# EasyEDA Pro project Dispenser Motor Controller.eprj, schematic Schematic1

## Sheets
1 P1: Board Name: Board1; Create Date: 2025-08-19; Page Name: P1; Project Name: Dispenser Motor Controller; Schematic Name: Schematic1; Update Date: 2025-12-11; Company: EasyEDA.com; Page Size: A4; Version: V1.0
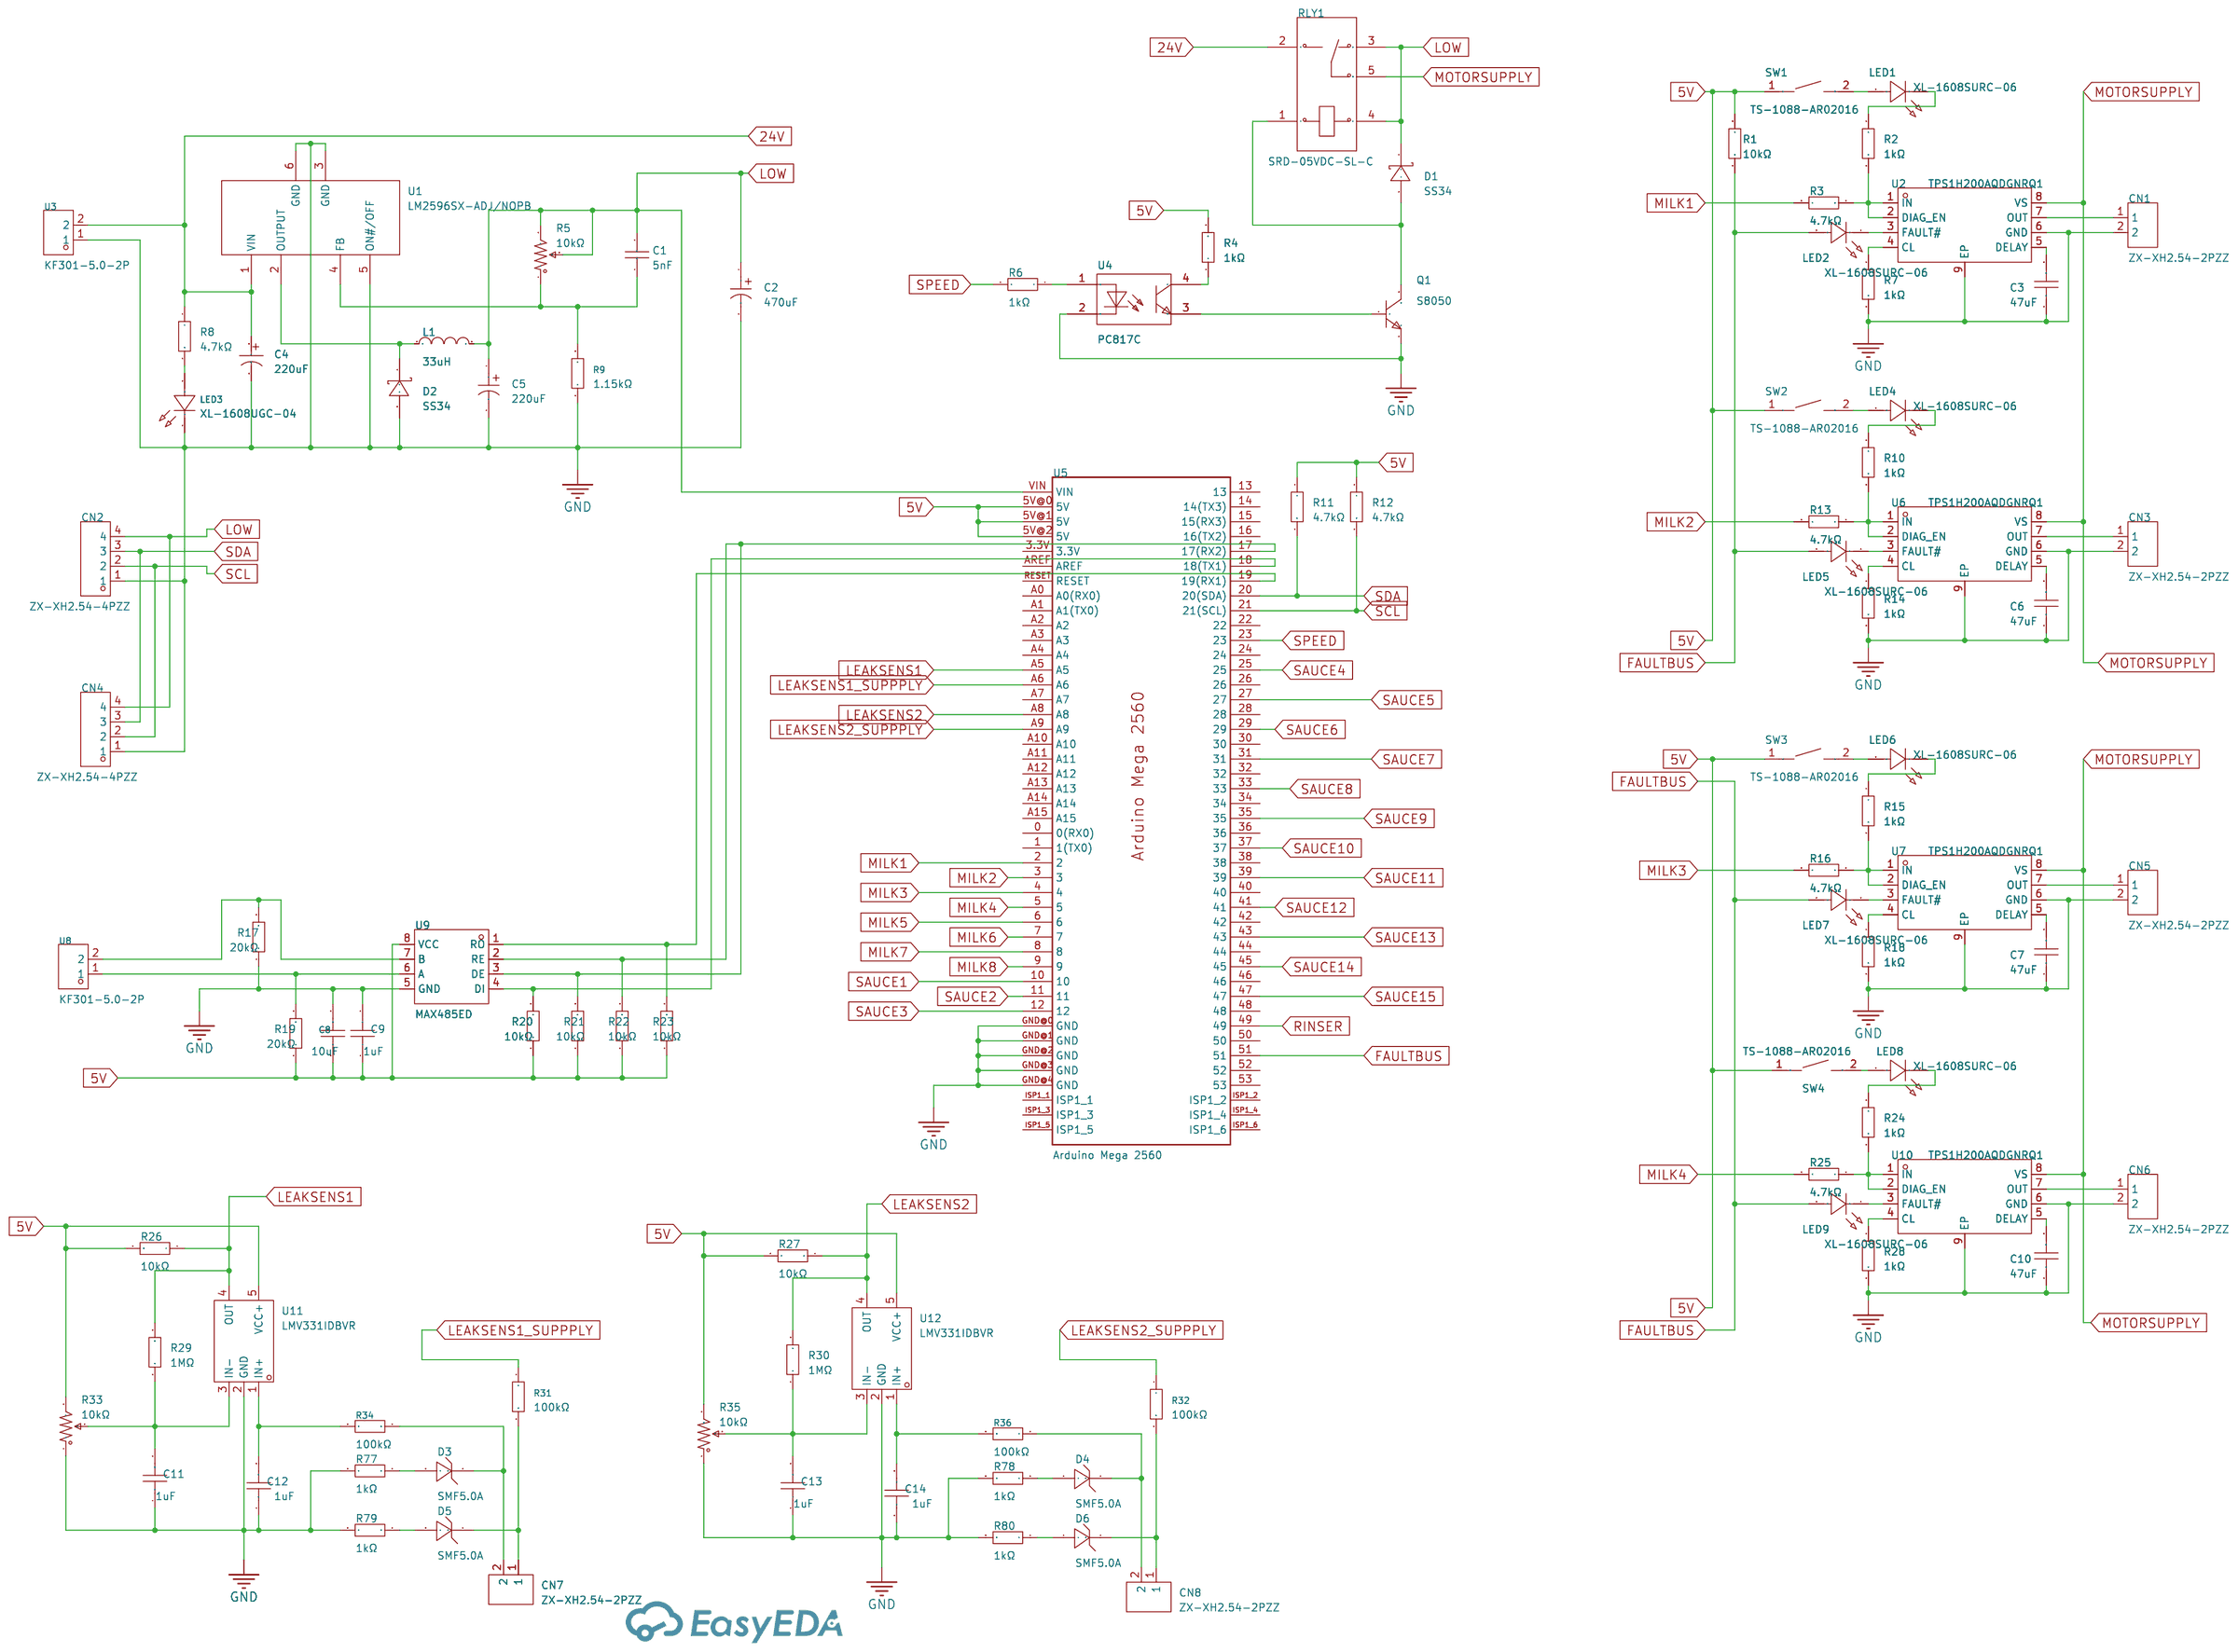
[diagram p0: P1]
2 P2: Create Date: 2025-08-20; Page Name: P2; Update Date: 2025-11-22
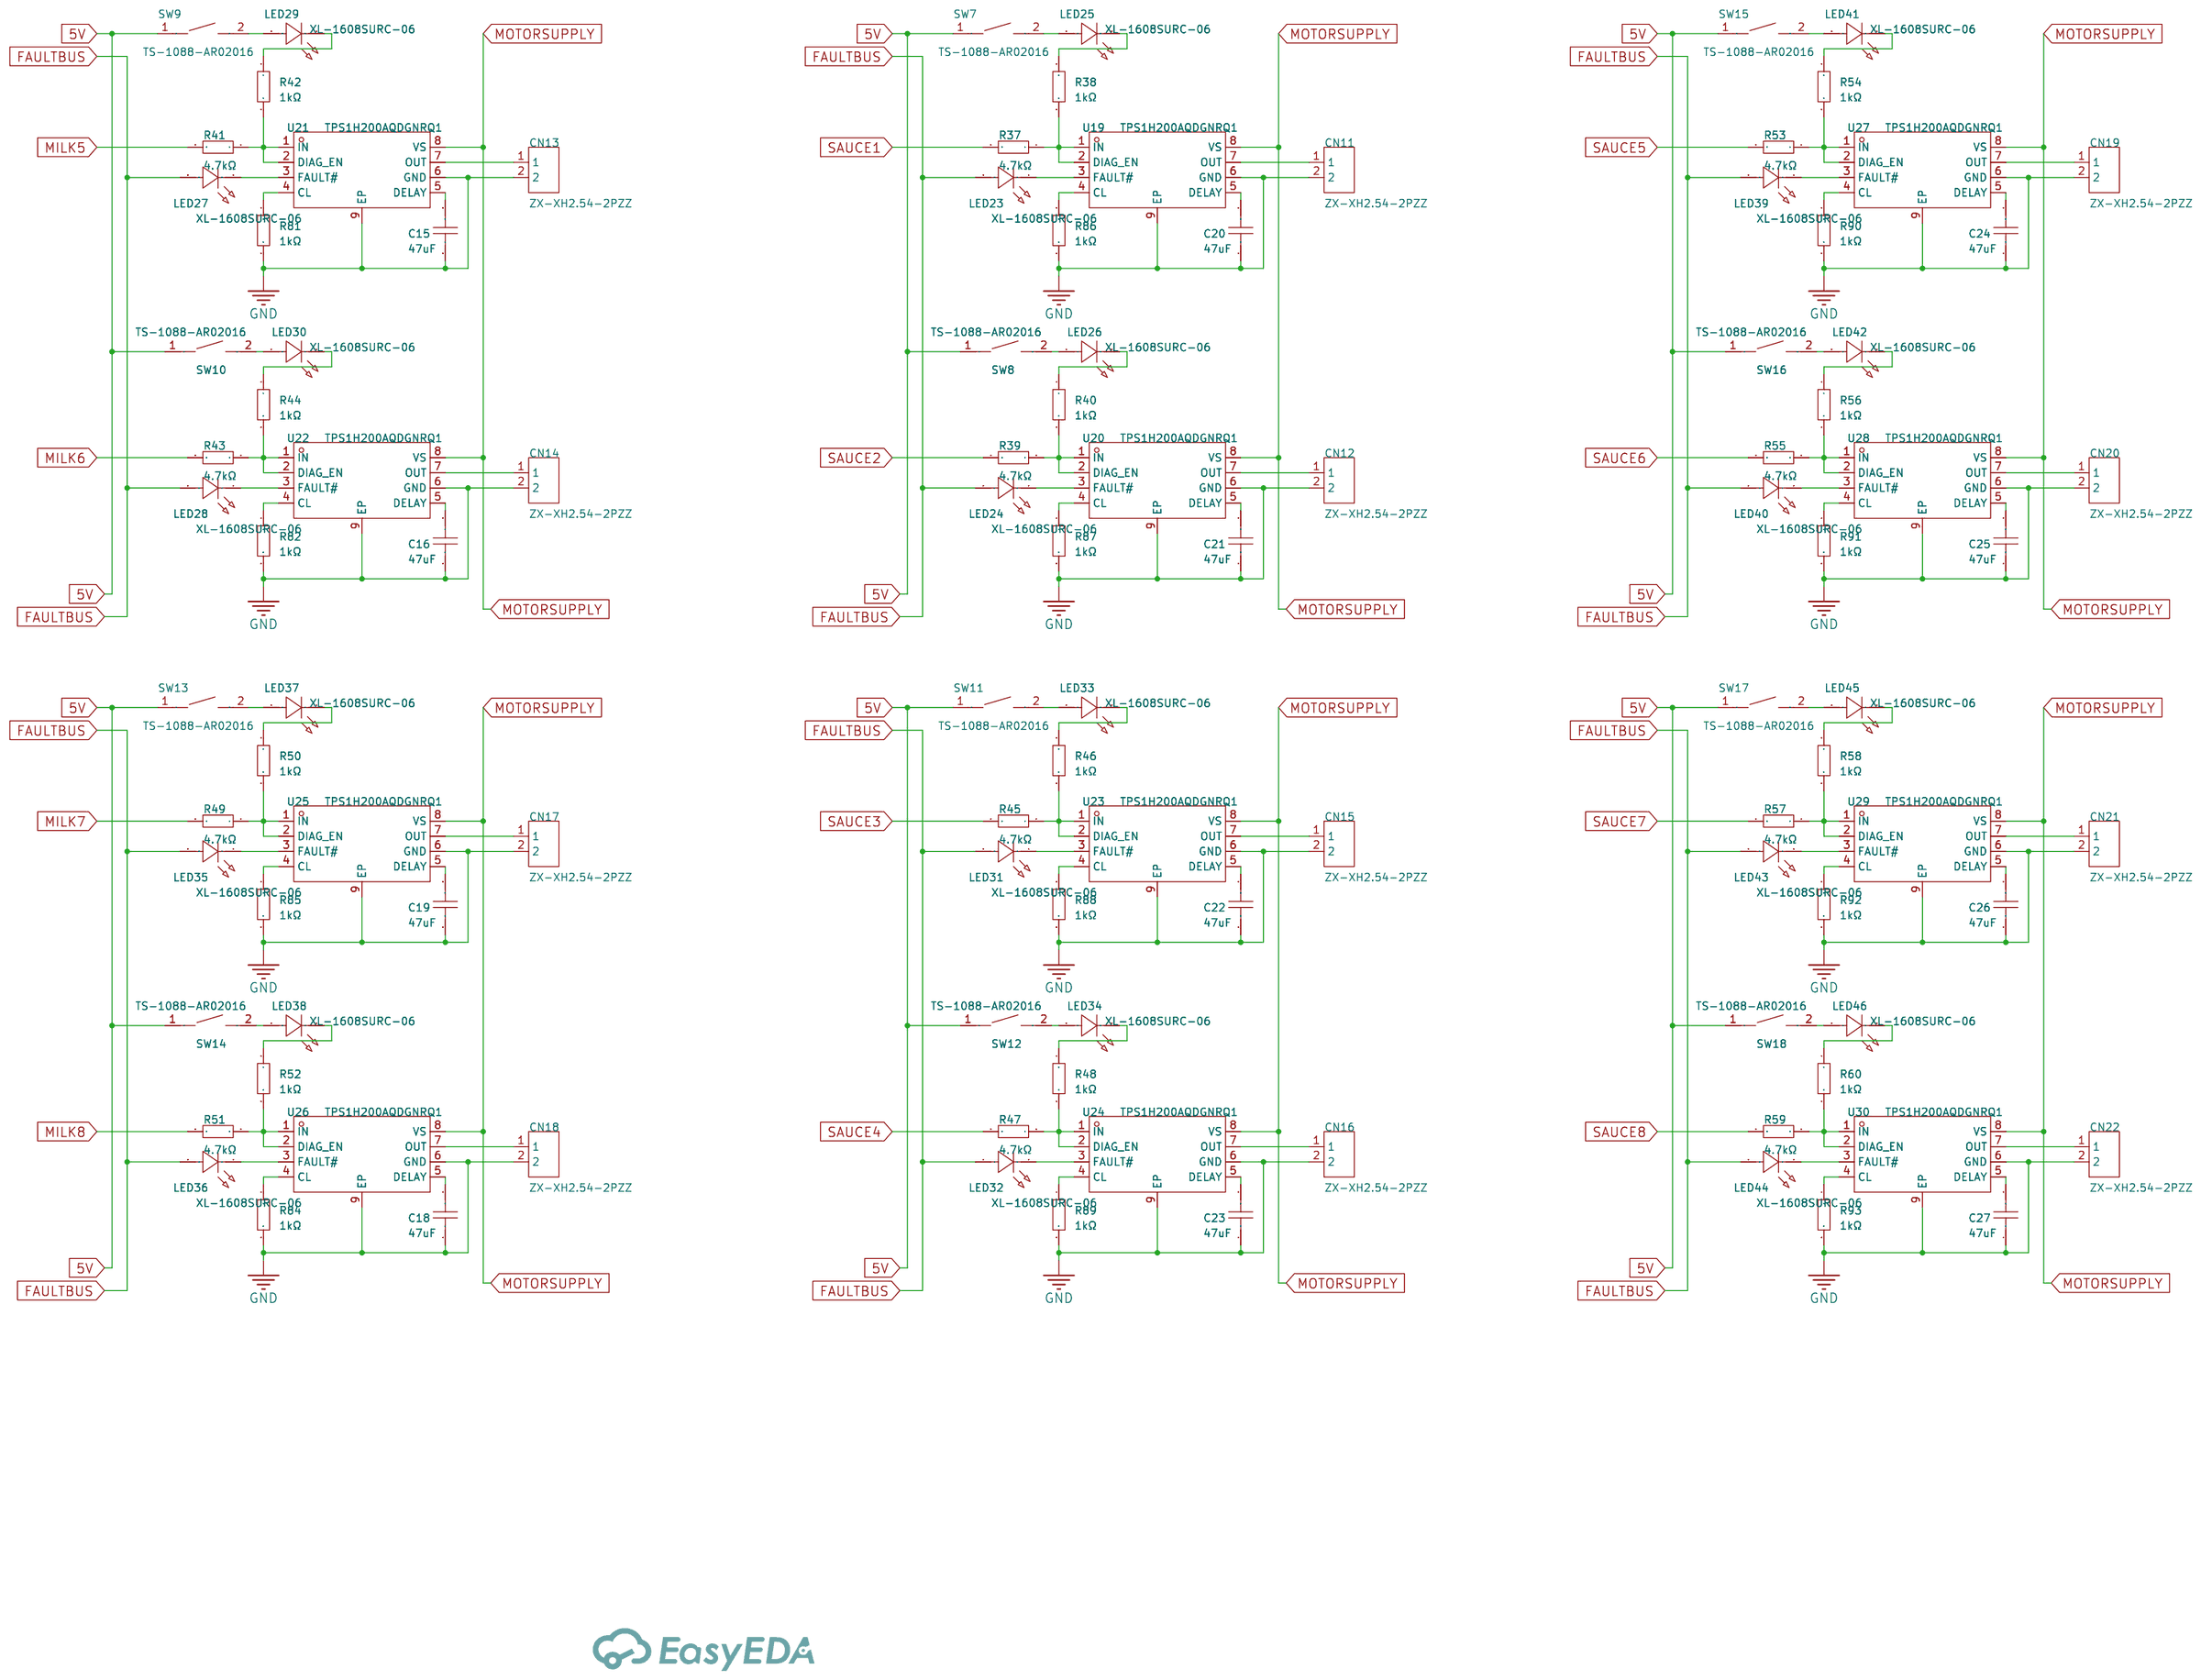
[diagram p1: P2]
3 P3: Create Date: 2025-08-20; Page Name: P3; Update Date: 2025-11-22
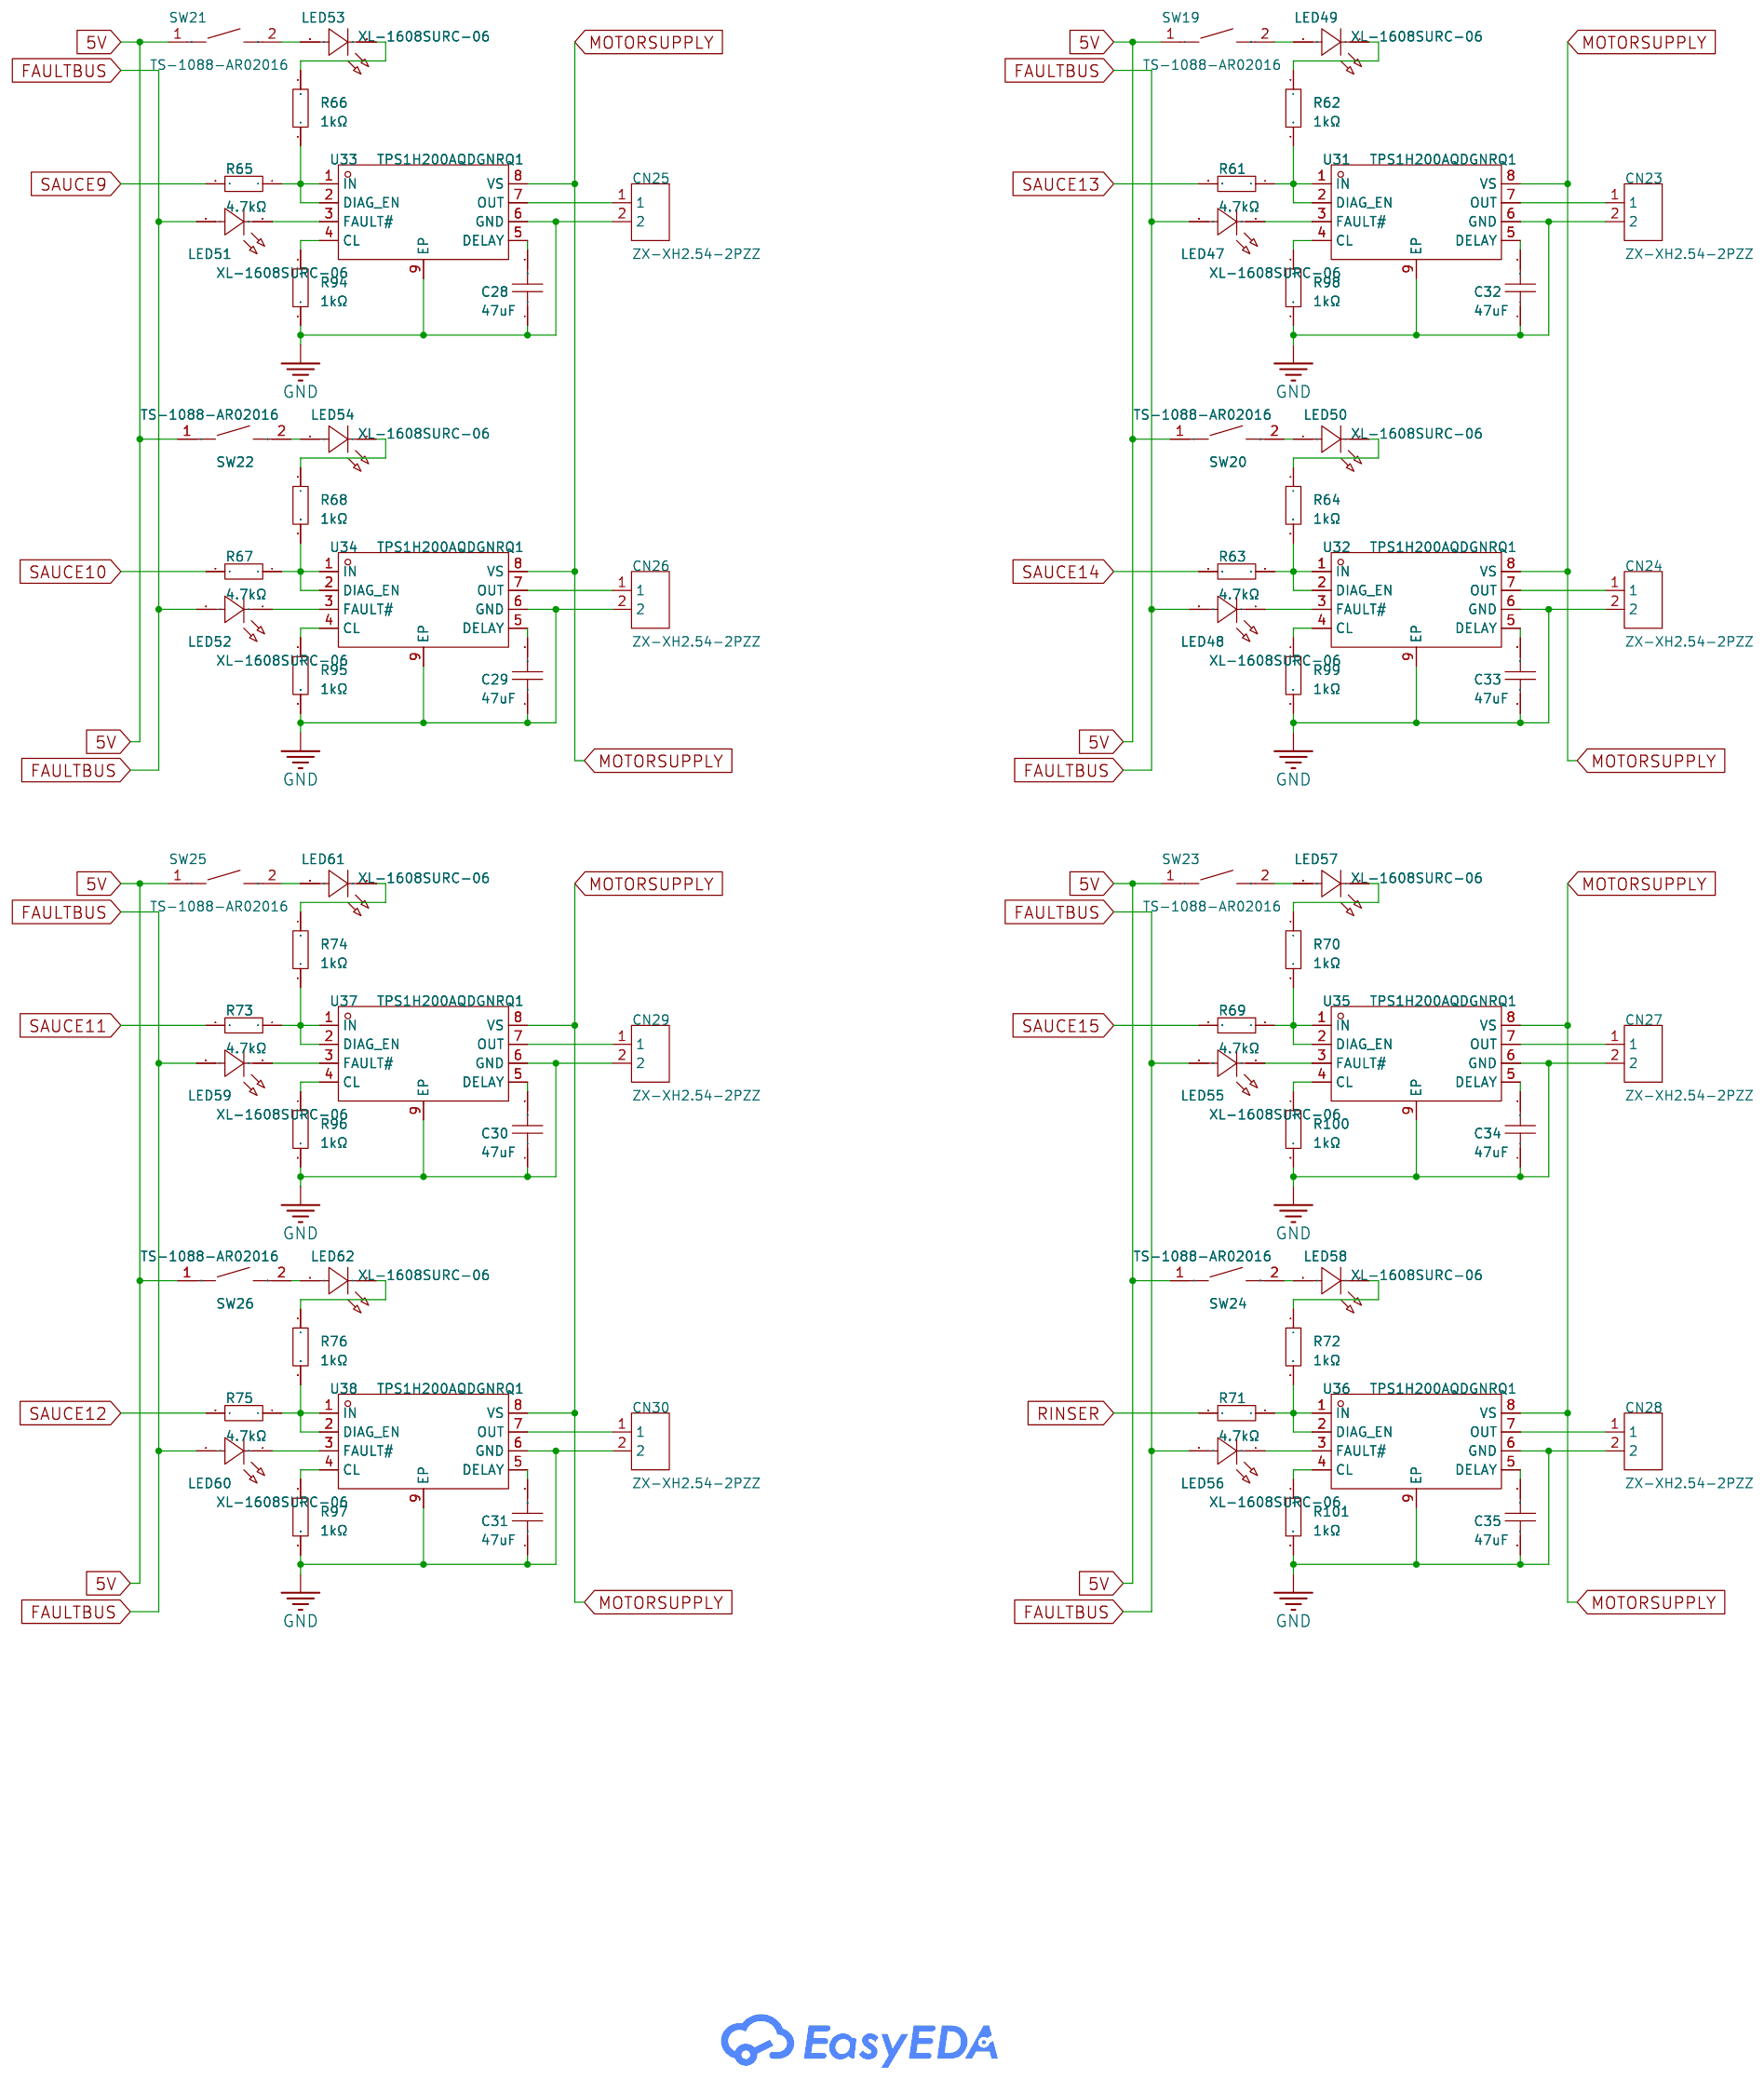
[diagram p2: P3]

## Parts
sheet P1
C1  5nF  [C0805]
C2  470uF  [CAP-SMD_BD8.0-L8.3-W8.3-LS9.1-FD]
C3  47uF  [C0603]
C4  220uF  [CAP-SMD_BD10.0-L10.3-W10.3-LS11.3-FD]
C5  220uF  [CAP-SMD_BD6.3-L6.6-W6.6-LS7.4-FD]
C6  47uF  [C0603]
C7  47uF  [C0603]
C8  10uF  [C0603]
C9  1uF  [C0603]
C10  47uF  [C0603]
C11  1uF  [C0603]
C12  1uF  [C0603]
C13  1uF  [C0603]
C14  1uF  [C0603]
CN1  ZX-XH2.54-2PZZ  [CONN-TH_2P-P2.50_HX25003-2A]
CN2  ZX-XH2.54-4PZZ  [CONN-TH_4P-P2.50_4PIN]
CN3  ZX-XH2.54-2PZZ  [CONN-TH_2P-P2.50_HX25003-2A]
CN4  ZX-XH2.54-4PZZ  [CONN-TH_4P-P2.50_4PIN]
CN5  ZX-XH2.54-2PZZ  [CONN-TH_2P-P2.50_HX25003-2A]
CN6  ZX-XH2.54-2PZZ  [CONN-TH_2P-P2.50_HX25003-2A]
CN7  ZX-XH2.54-2PZZ  [CONN-TH_2P-P2.50_HX25003-2A]
CN8  ZX-XH2.54-2PZZ  [CONN-TH_2P-P2.50_HX25003-2A]
D1  SS34  [SMA_L4.3-W2.6-LS5.2-RD]
D2  SS34  [SMA_L4.3-W2.6-LS5.2-RD]
D3  SMF5.0A  [SOD-123FL_L2.7-W1.8-LS3.8-RD]
D4  SMF5.0A  [SOD-123FL_L2.7-W1.8-LS3.8-RD]
D5  SMF5.0A  [SOD-123FL_L2.7-W1.8-LS3.8-RD]
D6  SMF5.0A  [SOD-123FL_L2.7-W1.8-LS3.8-RD]
L1  33uH  [IND-SMD_L12.3-W12.3]
LED1  XL-1608SURC-06  [LED0603-RD_RED]
LED2  XL-1608SURC-06  [LED0603-RD_RED]
LED3  XL-1608UGC-04  [LED0603-RD_GREEN]
LED4  XL-1608SURC-06  [LED0603-RD_RED]
LED5  XL-1608SURC-06  [LED0603-RD_RED]
LED6  XL-1608SURC-06  [LED0603-RD_RED]
LED7  XL-1608SURC-06  [LED0603-RD_RED]
LED8  XL-1608SURC-06  [LED0603-RD_RED]
LED9  XL-1608SURC-06  [LED0603-RD_RED]
Q1  S8050  [SOT-23-3_L2.9-W1.6-P1.90-LS2.8-BR]
R1  10kΩ  [R0603]
R2  1kΩ  [R0603]
R3  4.7kΩ  [R0603]
R4  1kΩ  [R0603]
R5  10kΩ  [RES-ADJ-TH_3P-L10.0-W10.0-P2.50-L]
R6  1kΩ  [R0603]
R7  1kΩ  [R0603]
R8  4.7kΩ  [R0603]
R9  1.15kΩ  [R0603]
R10  1kΩ  [R0603]
R11  4.7kΩ  [R0603]
R12  4.7kΩ  [R0603]
R13  4.7kΩ  [R0603]
R14  1kΩ  [R0603]
R15  1kΩ  [R0603]
R16  4.7kΩ  [R0603]
R17  20kΩ  [R0603]
R18  1kΩ  [R0603]
R19  20kΩ  [R0603]
R20  10kΩ  [R0603]
R21  10kΩ  [R0603]
R22  10kΩ  [R0603]
R23  10kΩ  [R0603]
R24  1kΩ  [R0603]
R25  4.7kΩ  [R0603]
R26  10kΩ  [R0603]
R27  10kΩ  [R0603]
R28  1kΩ  [R0603]
R29  1MΩ  [R0603]
R30  1MΩ  [R0603]
R31  100kΩ  [R0603]
R32  100kΩ  [R0603]
R33  10kΩ  [RES-ADJ-TH_3P-L10.0-W10.0-P2.50-L]
R34  100kΩ  [R0603]
R35  10kΩ  [RES-ADJ-TH_3P-L10.0-W10.0-P2.50-L]
R36  100kΩ  [R0603]
R77  1kΩ  [R0603]
R78  1kΩ  [R0603]
R79  1kΩ  [R0603]
R80  1kΩ  [R0603]
RLY1  SRD-05VDC-SL-C  [RELAY-TH_SRD-XXVDC-XL-C]
SW1  TS-1088-AR02016  [SW-SMD_L3.9-W3.0-P4.45]
SW2  TS-1088-AR02016  [SW-SMD_L3.9-W3.0-P4.45]
SW3  TS-1088-AR02016  [SW-SMD_L3.9-W3.0-P4.45]
SW4  TS-1088-AR02016  [SW-SMD_L3.9-W3.0-P4.45]
U1  LM2596SX-ADJ/NOPB  [TO-263-5_L10.2-W8.9-P1.70-TL]
U2  TPS1H200AQDGNRQ1  [EMSOP-8_L3.0-W3.0-P0.65-LS4.9-BL-EP-A]
U3  KF301-5.0-2P  [CONN-TH_P5.00_KF301-5.0-2P]
U4  PC817C  [OPTO-SMD-4_L4.6-W6.5-P2.54-LS10.3-TL]
U5  Arduino Mega 2560  [ARDUINO MEGA 2560 ADDON ON PCB]
U6  TPS1H200AQDGNRQ1  [EMSOP-8_L3.0-W3.0-P0.65-LS4.9-BL-EP-A]
U7  TPS1H200AQDGNRQ1  [EMSOP-8_L3.0-W3.0-P0.65-LS4.9-BL-EP-A]
U8  KF301-5.0-2P  [CONN-TH_P5.00_KF301-5.0-2P]
U9  MAX485ED  [SOP-8_L4.9-W3.9-P1.27-LS6.0-BL]
U10  TPS1H200AQDGNRQ1  [EMSOP-8_L3.0-W3.0-P0.65-LS4.9-BL-EP-A]
U11  LMV331IDBVR  [SOT-23-5_L3.0-W1.7-P0.95-LS2.8-BR]
U12  LMV331IDBVR  [SOT-23-5_L3.0-W1.7-P0.95-LS2.8-BR]
sheet P2
C15  47uF  [C0603]
C16  47uF  [C0603]
C18  47uF  [C0603]
C19  47uF  [C0603]
C20  47uF  [C0603]
C21  47uF  [C0603]
C22  47uF  [C0603]
C23  47uF  [C0603]
C24  47uF  [C0603]
C25  47uF  [C0603]
C26  47uF  [C0603]
C27  47uF  [C0603]
CN11  ZX-XH2.54-2PZZ  [CONN-TH_2P-P2.50_HX25003-2A]
CN12  ZX-XH2.54-2PZZ  [CONN-TH_2P-P2.50_HX25003-2A]
CN13  ZX-XH2.54-2PZZ  [CONN-TH_2P-P2.50_HX25003-2A]
CN14  ZX-XH2.54-2PZZ  [CONN-TH_2P-P2.50_HX25003-2A]
CN15  ZX-XH2.54-2PZZ  [CONN-TH_2P-P2.50_HX25003-2A]
CN16  ZX-XH2.54-2PZZ  [CONN-TH_2P-P2.50_HX25003-2A]
CN17  ZX-XH2.54-2PZZ  [CONN-TH_2P-P2.50_HX25003-2A]
CN18  ZX-XH2.54-2PZZ  [CONN-TH_2P-P2.50_HX25003-2A]
CN19  ZX-XH2.54-2PZZ  [CONN-TH_2P-P2.50_HX25003-2A]
CN20  ZX-XH2.54-2PZZ  [CONN-TH_2P-P2.50_HX25003-2A]
CN21  ZX-XH2.54-2PZZ  [CONN-TH_2P-P2.50_HX25003-2A]
CN22  ZX-XH2.54-2PZZ  [CONN-TH_2P-P2.50_HX25003-2A]
LED23  XL-1608SURC-06  [LED0603-RD_RED]
LED24  XL-1608SURC-06  [LED0603-RD_RED]
LED25  XL-1608SURC-06  [LED0603-RD_RED]
LED26  XL-1608SURC-06  [LED0603-RD_RED]
LED27  XL-1608SURC-06  [LED0603-RD_RED]
LED28  XL-1608SURC-06  [LED0603-RD_RED]
LED29  XL-1608SURC-06  [LED0603-RD_RED]
LED30  XL-1608SURC-06  [LED0603-RD_RED]
LED31  XL-1608SURC-06  [LED0603-RD_RED]
LED32  XL-1608SURC-06  [LED0603-RD_RED]
LED33  XL-1608SURC-06  [LED0603-RD_RED]
LED34  XL-1608SURC-06  [LED0603-RD_RED]
LED35  XL-1608SURC-06  [LED0603-RD_RED]
LED36  XL-1608SURC-06  [LED0603-RD_RED]
LED37  XL-1608SURC-06  [LED0603-RD_RED]
LED38  XL-1608SURC-06  [LED0603-RD_RED]
LED39  XL-1608SURC-06  [LED0603-RD_RED]
LED40  XL-1608SURC-06  [LED0603-RD_RED]
LED41  XL-1608SURC-06  [LED0603-RD_RED]
LED42  XL-1608SURC-06  [LED0603-RD_RED]
LED43  XL-1608SURC-06  [LED0603-RD_RED]
LED44  XL-1608SURC-06  [LED0603-RD_RED]
LED45  XL-1608SURC-06  [LED0603-RD_RED]
LED46  XL-1608SURC-06  [LED0603-RD_RED]
R37  4.7kΩ  [R0603]
R38  1kΩ  [R0603]
R39  4.7kΩ  [R0603]
R40  1kΩ  [R0603]
R41  4.7kΩ  [R0603]
R42  1kΩ  [R0603]
R43  4.7kΩ  [R0603]
R44  1kΩ  [R0603]
R45  4.7kΩ  [R0603]
R46  1kΩ  [R0603]
R47  4.7kΩ  [R0603]
R48  1kΩ  [R0603]
R49  4.7kΩ  [R0603]
R50  1kΩ  [R0603]
R51  4.7kΩ  [R0603]
R52  1kΩ  [R0603]
R53  4.7kΩ  [R0603]
R54  1kΩ  [R0603]
R55  4.7kΩ  [R0603]
R56  1kΩ  [R0603]
R57  4.7kΩ  [R0603]
R58  1kΩ  [R0603]
R59  4.7kΩ  [R0603]
R60  1kΩ  [R0603]
R81  1kΩ  [R0603]
R82  1kΩ  [R0603]
R84  1kΩ  [R0603]
R85  1kΩ  [R0603]
R86  1kΩ  [R0603]
R87  1kΩ  [R0603]
R88  1kΩ  [R0603]
R89  1kΩ  [R0603]
R90  1kΩ  [R0603]
R91  1kΩ  [R0603]
R92  1kΩ  [R0603]
R93  1kΩ  [R0603]
SW7  TS-1088-AR02016  [SW-SMD_L3.9-W3.0-P4.45]
SW8  TS-1088-AR02016  [SW-SMD_L3.9-W3.0-P4.45]
SW9  TS-1088-AR02016  [SW-SMD_L3.9-W3.0-P4.45]
SW10  TS-1088-AR02016  [SW-SMD_L3.9-W3.0-P4.45]
SW11  TS-1088-AR02016  [SW-SMD_L3.9-W3.0-P4.45]
SW12  TS-1088-AR02016  [SW-SMD_L3.9-W3.0-P4.45]
SW13  TS-1088-AR02016  [SW-SMD_L3.9-W3.0-P4.45]
SW14  TS-1088-AR02016  [SW-SMD_L3.9-W3.0-P4.45]
SW15  TS-1088-AR02016  [SW-SMD_L3.9-W3.0-P4.45]
SW16  TS-1088-AR02016  [SW-SMD_L3.9-W3.0-P4.45]
SW17  TS-1088-AR02016  [SW-SMD_L3.9-W3.0-P4.45]
SW18  TS-1088-AR02016  [SW-SMD_L3.9-W3.0-P4.45]
U19  TPS1H200AQDGNRQ1  [EMSOP-8_L3.0-W3.0-P0.65-LS4.9-BL-EP-A]
U20  TPS1H200AQDGNRQ1  [EMSOP-8_L3.0-W3.0-P0.65-LS4.9-BL-EP-A]
U21  TPS1H200AQDGNRQ1  [EMSOP-8_L3.0-W3.0-P0.65-LS4.9-BL-EP-A]
U22  TPS1H200AQDGNRQ1  [EMSOP-8_L3.0-W3.0-P0.65-LS4.9-BL-EP-A]
U23  TPS1H200AQDGNRQ1  [EMSOP-8_L3.0-W3.0-P0.65-LS4.9-BL-EP-A]
U24  TPS1H200AQDGNRQ1  [EMSOP-8_L3.0-W3.0-P0.65-LS4.9-BL-EP-A]
U25  TPS1H200AQDGNRQ1  [EMSOP-8_L3.0-W3.0-P0.65-LS4.9-BL-EP-A]
U26  TPS1H200AQDGNRQ1  [EMSOP-8_L3.0-W3.0-P0.65-LS4.9-BL-EP-A]
U27  TPS1H200AQDGNRQ1  [EMSOP-8_L3.0-W3.0-P0.65-LS4.9-BL-EP-A]
U28  TPS1H200AQDGNRQ1  [EMSOP-8_L3.0-W3.0-P0.65-LS4.9-BL-EP-A]
U29  TPS1H200AQDGNRQ1  [EMSOP-8_L3.0-W3.0-P0.65-LS4.9-BL-EP-A]
U30  TPS1H200AQDGNRQ1  [EMSOP-8_L3.0-W3.0-P0.65-LS4.9-BL-EP-A]
sheet P3
C28  47uF  [C0603]
C29  47uF  [C0603]
C30  47uF  [C0603]
C31  47uF  [C0603]
C32  47uF  [C0603]
C33  47uF  [C0603]
C34  47uF  [C0603]
C35  47uF  [C0603]
CN23  ZX-XH2.54-2PZZ  [CONN-TH_2P-P2.50_HX25003-2A]
CN24  ZX-XH2.54-2PZZ  [CONN-TH_2P-P2.50_HX25003-2A]
CN25  ZX-XH2.54-2PZZ  [CONN-TH_2P-P2.50_HX25003-2A]
CN26  ZX-XH2.54-2PZZ  [CONN-TH_2P-P2.50_HX25003-2A]
CN27  ZX-XH2.54-2PZZ  [CONN-TH_2P-P2.50_HX25003-2A]
CN28  ZX-XH2.54-2PZZ  [CONN-TH_2P-P2.50_HX25003-2A]
CN29  ZX-XH2.54-2PZZ  [CONN-TH_2P-P2.50_HX25003-2A]
CN30  ZX-XH2.54-2PZZ  [CONN-TH_2P-P2.50_HX25003-2A]
LED47  XL-1608SURC-06  [LED0603-RD_RED]
LED48  XL-1608SURC-06  [LED0603-RD_RED]
LED49  XL-1608SURC-06  [LED0603-RD_RED]
LED50  XL-1608SURC-06  [LED0603-RD_RED]
LED51  XL-1608SURC-06  [LED0603-RD_RED]
LED52  XL-1608SURC-06  [LED0603-RD_RED]
LED53  XL-1608SURC-06  [LED0603-RD_RED]
LED54  XL-1608SURC-06  [LED0603-RD_RED]
LED55  XL-1608SURC-06  [LED0603-RD_RED]
LED56  XL-1608SURC-06  [LED0603-RD_RED]
LED57  XL-1608SURC-06  [LED0603-RD_RED]
LED58  XL-1608SURC-06  [LED0603-RD_RED]
LED59  XL-1608SURC-06  [LED0603-RD_RED]
LED60  XL-1608SURC-06  [LED0603-RD_RED]
LED61  XL-1608SURC-06  [LED0603-RD_RED]
LED62  XL-1608SURC-06  [LED0603-RD_RED]
R61  4.7kΩ  [R0603]
R62  1kΩ  [R0603]
R63  4.7kΩ  [R0603]
R64  1kΩ  [R0603]
R65  4.7kΩ  [R0603]
R66  1kΩ  [R0603]
R67  4.7kΩ  [R0603]
R68  1kΩ  [R0603]
R69  4.7kΩ  [R0603]
R70  1kΩ  [R0603]
R71  4.7kΩ  [R0603]
R72  1kΩ  [R0603]
R73  4.7kΩ  [R0603]
R74  1kΩ  [R0603]
R75  4.7kΩ  [R0603]
R76  1kΩ  [R0603]
R94  1kΩ  [R0603]
R95  1kΩ  [R0603]
R96  1kΩ  [R0603]
R97  1kΩ  [R0603]
R98  1kΩ  [R0603]
R99  1kΩ  [R0603]
R100  1kΩ  [R0603]
R101  1kΩ  [R0603]
SW19  TS-1088-AR02016  [SW-SMD_L3.9-W3.0-P4.45]
SW20  TS-1088-AR02016  [SW-SMD_L3.9-W3.0-P4.45]
SW21  TS-1088-AR02016  [SW-SMD_L3.9-W3.0-P4.45]
SW22  TS-1088-AR02016  [SW-SMD_L3.9-W3.0-P4.45]
SW23  TS-1088-AR02016  [SW-SMD_L3.9-W3.0-P4.45]
SW24  TS-1088-AR02016  [SW-SMD_L3.9-W3.0-P4.45]
SW25  TS-1088-AR02016  [SW-SMD_L3.9-W3.0-P4.45]
SW26  TS-1088-AR02016  [SW-SMD_L3.9-W3.0-P4.45]
U31  TPS1H200AQDGNRQ1  [EMSOP-8_L3.0-W3.0-P0.65-LS4.9-BL-EP-A]
U32  TPS1H200AQDGNRQ1  [EMSOP-8_L3.0-W3.0-P0.65-LS4.9-BL-EP-A]
U33  TPS1H200AQDGNRQ1  [EMSOP-8_L3.0-W3.0-P0.65-LS4.9-BL-EP-A]
U34  TPS1H200AQDGNRQ1  [EMSOP-8_L3.0-W3.0-P0.65-LS4.9-BL-EP-A]
U35  TPS1H200AQDGNRQ1  [EMSOP-8_L3.0-W3.0-P0.65-LS4.9-BL-EP-A]
U36  TPS1H200AQDGNRQ1  [EMSOP-8_L3.0-W3.0-P0.65-LS4.9-BL-EP-A]
U37  TPS1H200AQDGNRQ1  [EMSOP-8_L3.0-W3.0-P0.65-LS4.9-BL-EP-A]
U38  TPS1H200AQDGNRQ1  [EMSOP-8_L3.0-W3.0-P0.65-LS4.9-BL-EP-A]

## Library data of the parts
C1 = 0805B502K500NT: LCSC Part Name: 5nF ±10% 50V; Supplier Part: C1748; Manufacturer: FH(风华); Supplier Footprint: 0805; JLCPCB Part Class: Extended Part; Datasheet: https://atta.szlcsc.com/upload/public/pdf/source/20200305/C486355_26A10D38EF8C2A5C37091D0039909270.pdf; Supplier: LCSC; Tolerance: ±10%; Voltage Rating: 50V; Temperature Coefficient: X7R
C2 = GVT1E477M0810CNVC: LCSC Part Name: 470uF ±20% 25V; Supplier Part: C2983319; Manufacturer: HRK(鸿瑞凯电子); Supplier Footprint: SMD,D8xL10.5mm; JLCPCB Part Class: Extended Part; Datasheet: https://item.szlcsc.com/datasheet/GVT1E477M0810CNVC/3419605.html; Supplier: LCSC; Tolerance: ±20%; Voltage Rating: 25V; Diameter: 8mm; Height - Seated (Max): 10.5mm; Lifetime: 2000hrs@105℃; Operating Temperature: -55℃~+105℃
C3 C6 C7 C10 C15 C16 C18-C35 = CGA0603X5R476M6R3JT: LCSC Part Name: 47uF ±20% 6.3V; Supplier Part: C6119831; Manufacturer: HRE(芯声); Supplier Footprint: 0603; JLCPCB Part Class: Extended Part; Datasheet: https://item.szlcsc.com/datasheet/CGA0603X5R476M6R3JT/7062537.html; Supplier: LCSC; Tolerance: ±20%; Voltage Rating: 6.3V; Temperature Coefficient: X5R
C4 = RVT1H221M1010_C72499: LCSC Part Name: 220uF ±20% 50V; Supplier Part: C72499; Manufacturer: ROQANG(容强); Manufacturer Part: RVT1H221M1010; Supplier Footprint: SMD,D10xL10.2mm; JLCPCB Part Class: Extended Part; Datasheet: https://item.szlcsc.com/datasheet/RVT1H221M1010/73610.html; Supplier: LCSC; Tolerance: ±20%; Voltage Rating: 50V; Ripple Current: 230mA@120Hz; Diameter: 10mm; Height - Seated (Max): 10.2mm; Lifetime: 2000hrs@105℃; Operating Temperature: -40℃~+105℃
C5 = RVT1E221M0607: LCSC Part Name: 220uF ±20% 25V; Supplier Part: C2918361; Manufacturer: ROQANG(容强); Supplier Footprint: SMD,D6.3xL7.7mm; JLCPCB Part Class: Extended Part; Datasheet: https://atta.szlcsc.com/upload/public/pdf/source/20241024/87413EF5140CF44BEEEC408A2EAB4036.pdf; Supplier: LCSC; Tolerance: ±20%; Ripple Current: 150mA@120Hz; Operating Temperature: -40℃~+105℃
C8 = CL10A106MQ8NNNC: Capacitance: Tolerance:±20% Tolerance:±20% Voltage Rated: Temperature Coefficient:; LCSC Part Name: 10uF ±20% 6.3V; Supplier Part: C1691; Manufacturer: SAMSUNG(三星); Supplier Footprint: 0603; JLCPCB Part Class: Extended Part; Datasheet: https://atta.szlcsc.com/upload/public/pdf/source/20160218/1457707763339.pdf; Supplier: LCSC; Tolerance: ±20%; Check: true
C9 C11-C14 = CL10A105KB8NNNC: Capacitance: Tolerance:±10% Tolerance:±10% Voltage Rated: Temperature Coefficient:; LCSC Part Name: 1uF ±10% 50V; Supplier Part: C15849; Manufacturer: SAMSUNG(三星); Supplier Footprint: 0603; JLCPCB Part Class: Basic Part; Datasheet: https://atta.szlcsc.com/upload/public/pdf/source/20160218/1457707763339.pdf; Supplier: LCSC; Tolerance: ±10%; Check: true
CN1 CN3 CN5-CN8 CN11-CN30 = ZX-XH2.54-2PZZ: LCSC Part Name: 1x2P 间距:2.5mm 直插 系列:XH; Supplier Part: C7429632; Manufacturer: Megastar(兆星); Supplier Footprint: 插件,P=2.5mm; JLCPCB Part Class: Extended Part; Datasheet: https://item.szlcsc.com/datasheet/ZX-XH2.54-2PZZ/8427549.html; Supplier: LCSC; Pins Structure: 1x2P; Pitch: 2.5mm; Mounting Type: Through Hole; Reference Series: XH; Number of Pins: 2P; Number of Rows: 1; Number of PINs Per Row: 2; Current Rating: 3A; Contact Material: Brass; Contact Plating: Tin; Operating Temperature: -25℃~+85℃; Voltage Rating: 250V; Plastic Material: PA66; Flame Retardant Rating: UL94V-0; Color: White; Z-Height of the Board: 7mm; X-Length of Bottom Edge on Board (Spacing Line): 7.5mm; Y-Width of Bottom Edge on Board: 5.9mm
CN2 CN4 = ZX-XH2.54-4PZZ: Pins Structure:1x4P Pitch:2.5mm Mounting Type:Through Hole Reference Series:XH Number of Pins:4P Number of Rows:1 Number of PINs Per Row:4 Row Spacing:- Current Rating:3A Contact Material:Brass Contact Plating:Tin Operating Temperature:-25℃~+85℃ Operating; LCSC Part Name: 1x4P 间距:2.5mm 直插 系列:XH; Supplier Part: C7429634; Manufacturer: Megastar(兆星); Supplier Footprint: 插件,P=2.5mm; JLCPCB Part Class: Extended Part; Datasheet: https://item.szlcsc.com/datasheet/ZX-XH2.54-4PZZ/8427551.html; Supplier: LCSC; Pins Structure: 1x4P; Pitch: 2.5mm; Mounting Type: Through Hole; Reference Series: XH; Number of Pins: 4P; Number of Rows: 1; Number of PINs Per Row: 4; Current Rating: 3A; Contact Material: Brass; Contact Plating: Tin; Operating Temperature: -25℃~+85℃; Voltage Rating: 250V; Plastic Material: PA66; Flame Retardant Rating: UL94V-0; Color: White; Z-Height of the Board: 7mm; X-Length of Bottom Edge on Board (Spacing Line): 12.5mm; Y-Width of Bottom Edge on Board: 5.9mm
D1 D2 = SS34_C8678: LCSC Part Name: 电压:40V 电流:3A; Supplier Part: C8678; Manufacturer: MDD(辰达半导体); Supplier Footprint: SMA(DO-214AC); JLCPCB Part Class: Basic Part; Datasheet: https://item.szlcsc.com/datasheet/SS34/9178.html; Supplier: LCSC; Diode Configuration: Independent; Voltage - Forward(Vf@If): 550mV@3A; Voltage - DC Reverse(Vr): 40V; Current - Rectified: 3A; Reverse Leakage Current (Ir): 500uA@40V; Operating Junction Temperature Range: -55℃~+125℃
D3-D6 = SMF5.0A_C193402: LCSC Part Name: 单向TVS 5V截止 21.7A峰值脉冲; Supplier Part: C193402; Manufacturer: MDD(辰达半导体); Supplier Footprint: SOD-123FL; JLCPCB Part Class: Extended Part; Datasheet: https://item.szlcsc.com/datasheet/SMF5.0A/231120.html; Supplier: LCSC; Polarity: Unidirectional; Reverse Stand-Off Voltage (Vrwm): 5V; Clamping Voltage: 9.2V; Peak Pulse Current (Ipp): 21.7A@10/1000us; Peak Pulse Power Dissipation (Ppp): 200W@10/1000us; Voltage - Breakdown: 7V; Reverse Leakage Current (Ir): 400uA; Operating Temperature: -55℃~+150℃; Type: TVS
L1 = SMDRI127-330MT: LCSC Part Name: 33uH ±20% 5.5A; Supplier Part: C9400; Manufacturer: SXN(顺翔诺); Supplier Footprint: SMD,12.3x12.3mm; JLCPCB Part Class: Extended Part; Datasheet: https://atta.szlcsc.com/upload/public/pdf/source/20210810/6F96FDC19AA308DD2AD166FFB9640E87.pdf; Supplier: LCSC; Tolerance: ±20%; Saturation Current (Isat): 5.5A; Type: 屏蔽电感
LED1 LED2 LED4-LED9 LED23-LED62 = XL-1608SURC-06: Supplier Part: C965799; Manufacturer: XINGLIGHT(成兴光); Supplier Footprint: 0603; JLCPCB Part Class: Extended Part; Datasheet: https://atta.szlcsc.com/upload/public/pdf/source/20250213/F9766CE804AF391355DCDD48DB3E0DAB.pdf; Supplier: LCSC; Illumination Color: Red; Voltage - Forward(Vf): 2.3V; Power(Watts): 50mW; Forward Current: 20mA; Wavelength - Dominant: 620nm~630nm; Peak Wavelength: 625nm; Lens Color: Colorless Transparent Lens; Luminous Intensity: 225mcd; Viewing Angle: 120°; Mounting Sytle: Positive Stick; Operating Temperature: -20℃~+85℃
LED3 = XL-1608UGC-04: Lamp Holder Type:- Illumination Color:Emerald Green Voltage - Forward(Vf):3.3V Voltage - Forward(Vf):3.3V Power(Watts):70mW Forward Current:20mA Wavelength - Dominant:515nm~535nm Wavelength - Dominant:515nm~535nm Peak Wavelength:525nm Diode Configuration:; Supplier Part: C965804; Manufacturer: XINGLIGHT(成兴光); Supplier Footprint: 0603; JLCPCB Part Class: Extended Part; Datasheet: https://atta.szlcsc.com/upload/public/pdf/source/20250225/C314F1E3DD818220782E352D4A9DC75E.pdf; Supplier: LCSC; Illumination Color: Emerald Green; Voltage - Forward(Vf): 3.3V; Power(Watts): 70mW; Forward Current: 20mA; Wavelength - Dominant: 515nm~535nm; Peak Wavelength: 525nm; Diode Configuration: Discrete Diode; Lens Color: Water Clear; Luminous Intensity: 810mcd; Viewing Angle: 120°; Mounting Style: op View Mount; Check: true
Q1 = S8050_C181158: LCSC Part Name: NPN 电流:500mA 耐压:25V H档; Supplier Part: C181158; Manufacturer: Hottech(合科泰); Supplier Footprint: SOT-23; JLCPCB Part Class: Extended Part; Datasheet: https://atta.szlcsc.com/upload/public/pdf/source/20220506/D987F39D56F2975D34EC7947E75C4ABC.pdf; Supplier: LCSC; Transition Frequency (fT): 150MHz; Collector Cut-Off Current (Icbo): 100nA; Collector-Emitter Saturation Voltage (VCE(sat)@Ic,Ib): 600mV@500mA,50mA
R1 R20-R23 R26 R27 = RC0603FR-0710KL: Type:Thick Film Resistors Resistance: Tolerance:±1% Tolerance:±1% Power(Watts): Overload Voltage (Max): Temperature Coefficient:±100ppm/℃ Temperature Coefficient:±100ppm/℃ Operating Temperature Range:-55℃~+155℃ Operating Temperature Range:-55℃~+155℃; LCSC Part Name: 厚膜电阻 10kΩ ±1% 100mW; Supplier Part: C98220; Manufacturer: YAGEO(国巨); Supplier Footprint: 0603; JLCPCB Part Class: Extended Part; Datasheet: https://atta.szlcsc.com/upload/public/pdf/source/20180927/C295883_E8D83085EA81BD7DE0B2B681138C15EE.pdf; Supplier: LCSC; Type: Thick Film Resistors; Tolerance: ±1%; Temperature Coefficient: ±100ppm/℃; Operating Temperature Range: -55℃~+155℃; Check: true
R2 R4 R6 R7 R10 R14 R15 R18 R24 R28 R38 R40 R42 R44 R46 R48 R50 R52 R54 R56 R58 R60 R62 R64 R66 R68 R70 R72 R74 R76-R82 R84-R101 = 0603WAF1001T5E: Type:Thick Film Resistors Resistance:1kΩ Tolerance:±1% Tolerance:±1% Power(Watts): Overload Voltage (Max): Temperature Coefficient:±100ppm/℃ Temperature Coefficient:±100ppm/℃ Operating Temperature Range:-55℃~+155℃ Operating Temperature Range:-55℃~+155℃; LCSC Part Name: 1kΩ ±1% 100mW 厚膜电阻; Supplier Part: C21190; Manufacturer: UNI-ROYAL(厚声); Supplier Footprint: 0603; JLCPCB Part Class: Basic Part; Datasheet: https://atta.szlcsc.com/upload/public/pdf/source/20200306/C422600_1E6D84923E4A46A82E41ADD87F860B5C.pdf; Supplier: LCSC; Type: Thick Film Resistors; Tolerance: ±1%; Temperature Coefficient: ±100ppm/℃; Operating Temperature Range: -55℃~+155℃
R3 R8 R11-R13 R16 R25 R37 R39 R41 R43 R45 R47 R49 R51 R53 R55 R57 R59 R61 R63 R65 R67 R69 R71 R73 R75 = 0603WAF4701T5E: Type:Thick Film Resistor Resistance:4.7kΩ Tolerance:±1% Tolerance:±1% Power(Watts):100mW Voltage-Supply(Max):75V Temperature Coefficient:±100ppm/℃ Temperature Coefficient:±100ppm/℃ Operating Temperature:-55℃~+155℃ Operating Temperature:-55℃~+155℃; LCSC Part Name: 4.7kΩ ±1% 100mW 厚膜电阻; Supplier Part: C23162; Manufacturer: UNI-ROYAL(厚声); Supplier Footprint: 0603; JLCPCB Part Class: Basic Part; Datasheet: https://item.szlcsc.com/datasheet/0603WAF4701T5E/23889.html; Supplier: LCSC; Type: Thick Film Resistor; Tolerance: ±1%; Power(Watts): 100mW; Voltage-Supply(Max): 75V; Temperature Coefficient: ±100ppm/℃; Operating Temperature: -55℃~+155℃
R5 R33 R35 = 3296W-1-103_C118954: LCSC Part Name: 10kΩ ±10%; Supplier Part: C118954; Manufacturer: BOCHEN(博晨); Manufacturer Part: 3296W-1-103; Supplier Footprint: 插件; JLCPCB Part Class: Extended Part; Datasheet: https://atta.szlcsc.com/upload/public/pdf/source/20171114/C118954_15106326646611117443.pdf; Supplier: LCSC; Tolerance: ±10%
R9 = 0603WAF1151T5E: LCSC Part Name: 1.15kΩ ±1% 100mW 厚膜电阻; Supplier Part: C22834; Manufacturer: UNI-ROYAL(厚声); Supplier Footprint: 0603; JLCPCB Part Class: Extended Part; Datasheet: https://item.szlcsc.com/datasheet/0603WAF1151T5E/23561.html; Supplier: LCSC; Type: Thick Film Resistor; Tolerance: ±1%; Power(Watts): 100mW; Voltage-Supply(Max): 75V; Temperature Coefficient: ±100ppm/℃; Operating Temperature: -55℃~+155℃
R17 R19 = SCR0603J20K: Type:Thick Film Resistors Resistance: Tolerance:±5% Tolerance:±5% Power(Watts): Overload Voltage (Max): Operating Temperature Range:-55℃~+155℃ Operating Temperature Range:-55℃~+155℃; LCSC Part Name: 厚膜电阻 20kΩ ±5% 100mW; Supplier Part: C3017708; Manufacturer: VO(翔胜); Supplier Footprint: 0603; JLCPCB Part Class: Extended Part; Datasheet: https://atta.szlcsc.com/upload/public/pdf/source/20220513/247AF9639BA21CF93567DC289CCC6A22.pdf; Supplier: LCSC; Type: Thick Film Resistors; Tolerance: ±5%; Operating Temperature Range: -55℃~+155℃; Check: true
R29 R30 = RC0603FR-071ML: LCSC Part Name: 厚膜电阻 1MΩ ±1% 100mW; Supplier Part: C105578; Manufacturer: YAGEO(国巨); Supplier Footprint: 0603; JLCPCB Part Class: Extended Part; Datasheet: https://atta.szlcsc.com/upload/public/pdf/source/20181102/C105578_67A9388250AF143DE4682E62257D2969.pdf; Supplier: LCSC; Type: Thick Film Resistors; Tolerance: ±1%; Temperature Coefficient: ±100ppm/℃; Operating Temperature Range: -55℃~+155℃
R31 R32 R34 R36 = RC0603FR-07100KL: LCSC Part Name: 厚膜电阻 100kΩ ±1% 100mW; Supplier Part: C14675; Manufacturer: YAGEO(国巨); Supplier Footprint: 0603; JLCPCB Part Class: Extended Part; Datasheet: https://atta.szlcsc.com/upload/public/pdf/source/20140324/1457707028752.pdf; Supplier: LCSC; Type: Thick Film Resistors; Tolerance: ±1%; Temperature Coefficient: ±100ppm/℃; Operating Temperature Range: -55℃~+155℃
RLY1 = SRD-05VDC-SL-C: LCSC Part Name: 蓝色 单组转换型继电器; Supplier Part: C35449; Manufacturer: 松乐; Supplier Footprint: 插件,15.6x19.2mm; JLCPCB Part Class: Extended Part; Datasheet: https://item.szlcsc.com/datasheet/SRD-05VDC-SL-C/36422.html; Supplier: LCSC; Coil Voltage: 5V; Contact Form: 1 Form C: 1C (SPDT-CO); Number of Pins: 5; Switching Voltage(Max): 250V@AC; Coil Rated Power: 360mW; Switching Current(Max): 15A; Coil Type: Non-Polarized - Single Coil; Coil Resistance: 70Ω; Contact Resistance: 100mΩ; Operate Time: 10ms; Release Time: 10ms
SW1-SW4 SW7-SW26 = TS-1088-AR02016: LCSC Part Name: 4*3*2mm 立贴 轻触开关; Supplier Part: C720477; Manufacturer: XUNPU(讯普); Supplier Footprint: SMD; JLCPCB Part Class: Basic Part; Datasheet: https://atta.szlcsc.com/upload/public/pdf/source/20200810/C720475_60D09DD6C54279ADDB2DC25100F1CC11.pdf; Supplier: LCSC; Circuit: SPST; Actuator Style: Round Button; Operating Force: 160gf; Mounting Style: Brick nogging; Switch Length: 4mm; Switch Width: 3mm; Switch Height: 2mm; Strike Gundam: 不带; Contact Current: 50mA; Voltage Rating (DC): 12V; Insulation Resistance: 100MΩ; Actuator/Cap Color: Black; Pin Style: SMDSplicing; Mechanical Life: 10万次; Operating Temperature: -30℃~+80℃
U1 = LM2596SX-ADJ/NOPB: LCSC Part Name: LM2596 SIMPLE SWITCHER® 3A 降压稳压器; Supplier Part: C29781; Manufacturer: TI(德州仪器); Supplier Footprint: TO-263-5; JLCPCB Part Class: Extended Part; Datasheet: https://www.ti.com/cn/lit/gpn/lm2596; Supplier: LCSC; Function: Step-down type; Output Type: Adjustable; Input Voltage: 4.5V~40V; Output Voltage: 1.2V~37V; Output Current: 3A; Switching Frequency: 150kHz; Operating Temperature: -40℃~+125℃; Synchronous Rectification: No; Number of Outputs: 1; Topology: Step-down; Quiescent Current (Iq): 80uA; Switch tube (built-in/external): Built-in
U2 U6 U7 U10 U19-U38 = TPS1H200AQDGNRQ1: Supplier Part: C2653785; Manufacturer: TI(德州仪器); Supplier Footprint: EMSOP-8-EP; JLCPCB Part Class: Extended Part; Datasheet: https://www.ti.com/cn/lit/gpn/tps1h200a-q1; Supplier: LCSC; Type: High Side Switch; Number of Channels: 1; Voltage - Supply: 3.4V~40V; RDS(on): 200mΩ; Operating Temperature	-: -40℃~+125℃
U3 U8 = KF301-5.0-2P: Structure:1x2P Pitch:5mm Color:Blue Mounting Style:Straight Current Rating (Max):17A Voltage Rating (Max):250V Number of Pins:2P Number of Rows:1 Wire Gauge - AWG:14~22 Wire Gauge - AWG:14~22 Wire Gauge - mm2:1.5 Wire Gauge - mm2:1.5 Number of PINs Per Ro; LCSC Part Name: 5mm 1x2P 排数:1 每排P数:2 直插; Supplier Part: C474881; Manufacturer: KEFA(科发); Supplier Footprint: 插件,P=5mm; JLCPCB Part Class: Extended Part; Datasheet: https://atta.szlcsc.com/upload/public/pdf/source/20230317/03A5B5FC229D6F9225E8F51DA1A4E80A.pdf; Supplier: LCSC; Structure: 1x2P; Pitch: 5mm; Color: Blue; Mounting Style: Straight; Current Rating (Max): 17A; Voltage Rating (Max): 250V; Number of Pins: 2P; Number of Rows: 1; Wire Gauge - AWG: 14~22; Wire Gauge - mm2: 1.5; Number of PINs Per Row: 2; Operating Temperature Range: -30℃~+120℃
U4 = PC817C_C3025164: LCSC Part Name: C档 PC817C C档; Supplier Part: C3025164; Manufacturer: GOODWORK(固得沃克); Supplier Footprint: SMD-4P; JLCPCB Part Class: Extended Part; Datasheet: https://item.szlcsc.com/datasheet/PC817C/3553773.html; Supplier: LCSC; Input voltage type: DC; Output Type: Phototransistor; Voltage - Forward(Vf): 1.2V; Output Current: 50mA; Isolation Voltage(Vrms): 5kV; Reverse Voltage: 6V; Load Voltage: 35V; Number of Outputs: 1; Vce Saturation(VCE(sat)): 100mV@1mA,20mA; Rise time: 6us@2mA,100Ω; Fall time: 5us@2mA,100Ω; Operating Temperature: -55℃~+110℃; Current Transfer Ratio (CTR) Minimum: 200%; Current Transfer Ratio (CTR) Maximum/Saturation Value: 400%
U5 = Arduino Mega 2560
U9 = MAX485ED: LCSC Part Name: 低功耗、限摆率的RS-485/RS-422收发器; Supplier Part: C481667; Manufacturer: HTC; Supplier Footprint: SOP-8; JLCPCB Part Class: Extended Part; Datasheet: https://atta.szlcsc.com/upload/public/pdf/source/20200113/C481667_86CA12344B2034BBC3F3085D860BEB7C.pdf; Supplier: LCSC; Check: true
U11 U12 = LMV331IDBVR: Supplier Part: C34731; Manufacturer: TI(德州仪器); Supplier Footprint: SOT-23-5; JLCPCB Part Class: Extended Part; Datasheet: https://www.ti.com/cn/lit/gpn/lmv331; Supplier: LCSC; Input Offset Voltage (Vos): 7mV; Input Bias Current (Ib): 250nA; Propagation Delay Time: 600ns; Supply Voltage: 2.7V~5.5V; Output Type: 开集; Supply Current: 150uA; Operating Temperature: -40℃~+85℃

## Nets
5V: C8.1 C9.1 R1.2 R4.2 R11.1 R12.1 R19.1 R20.1 R21.1 R22.1 R23.1 R26.2 R27.2 R33.3 R35.3 SW1.1 SW2.1 SW3.1 SW4.1 SW7.1 SW8.1 SW9.1 SW10.1 SW11.1 SW12.1 SW13.1 SW14.1 SW15.1 SW16.1 SW17.1 SW18.1 SW19.1 SW20.1 SW21.1 SW22.1 SW23.1 SW24.1 SW25.1 SW26.1 U5.5V@0(5V) U5.5V@1(5V) U5.5V@2(5V) U9.8(VCC) U11.5(VCC+) U12.5(VCC+)
24V: C4.1 R8.1 RLY1.2 U1.1(VIN) U3.2
GND: C2.2 C3.1 C4.2 C5.2 C6.1 C7.1 C8.2 C9.2 C10.1 C11.1 C12.1 C13.1 C14.1 C15.1 C16.1 C18.1 C19.1 C20.1 C21.1 C22.1 C23.1 C24.1 C25.1 C26.1 C27.1 C28.1 C29.1 C30.1 C31.1 C32.1 C33.1 C34.1 C35.1 CN1.2 CN2.1 CN3.2 CN4.1 CN5.2 CN6.2 CN11.2 CN12.2 CN13.2 CN14.2 CN15.2 CN16.2 CN17.2 CN18.2 CN19.2 CN20.2 CN21.2 CN22.2 CN23.2 CN24.2 CN25.2 CN26.2 CN27.2 CN28.2 CN29.2 CN30.2 D2.2(A) LED3.1(K) Q1.2 R7.2 R9.1 R14.2 R17.1 R18.2 R28.2 R33.1 R35.1 R77.2 R78.2 R79.2 R80.2 R81.2 R82.2 R84.2 R85.2 R86.2 R87.2 R88.2 R89.2 R90.2 R91.2 R92.2 R93.2 R94.2 R95.2 R96.2 R97.2 R98.2 R99.2 R100.2 R101.2 U1.3(GND) U1.5(ON#/OFF) U1.6(GND) U2.6(GND) U2.9(EP) U3.1 U4.2 U5.GND@0(GND) U5.GND@1(GND) U5.GND@2(GND) U5.GND@3(GND) U5.GND@4(GND) U6.6(GND) U6.9(EP) U7.6(GND) U7.9(EP) U9.5(GND) U10.6(GND) U10.9(EP) U11.2(GND) U12.2(GND) U19.6(GND) U19.9(EP) U20.6(GND) U20.9(EP) U21.6(GND) U21.9(EP) U22.6(GND) U22.9(EP) U23.6(GND) U23.9(EP) U24.6(GND) U24.9(EP) U25.6(GND) U25.9(EP) U26.6(GND) U26.9(EP) U27.6(GND) U27.9(EP) U28.6(GND) U28.9(EP) U29.6(GND) U29.9(EP) U30.6(GND) U30.9(EP) U31.6(GND) U31.9(EP) U32.6(GND) U32.9(EP) U33.6(GND) U33.9(EP) U34.6(GND) U34.9(EP) U35.6(GND) U35.9(EP) U36.6(GND) U36.9(EP) U37.6(GND) U37.9(EP) U38.6(GND) U38.9(EP)
FAULTBUS: LED2.2(A) LED5.2(A) LED7.2(A) LED9.2(A) LED23.2(A) LED24.2(A) LED27.2(A) LED28.2(A) LED31.2(A) LED32.2(A) LED35.2(A) LED36.2(A) LED39.2(A) LED40.2(A) LED43.2(A) LED44.2(A) LED47.2(A) LED48.2(A) LED51.2(A) LED52.2(A) LED55.2(A) LED56.2(A) LED59.2(A) LED60.2(A) R1.1 U5.51
LEAKSENS1: R26.1 R29.2 U5.A5 U11.4(OUT)
LEAKSENS1_SUPPPLY: R31.1 U5.A6
LEAKSENS2: R27.1 R30.2 U5.A8 U12.4(OUT)
LEAKSENS2_SUPPPLY: R32.1 U5.A9
LOW: C1.2 C2.1 C5.1 CN2.4 CN4.4 D1.1(K) L1.2 R5.2 R5.3 RLY1.3 RLY1.4 U5.VIN
MILK1: R3.2 U5.2
MILK2: R13.2 U5.3
MILK3: R16.2 U5.4
MILK4: R25.2 U5.5
MILK5: R41.2 U5.6
MILK6: R43.2 U5.7
MILK7: R49.2 U5.8
MILK8: R51.2 U5.9
MOTORSUPPLY: RLY1.5 U2.8(VS) U6.8(VS) U7.8(VS) U10.8(VS) U19.8(VS) U20.8(VS) U21.8(VS) U22.8(VS) U23.8(VS) U24.8(VS) U25.8(VS) U26.8(VS) U27.8(VS) U28.8(VS) U29.8(VS) U30.8(VS) U31.8(VS) U32.8(VS) U33.8(VS) U34.8(VS) U35.8(VS) U36.8(VS) U37.8(VS) U38.8(VS)
RINSER: R71.2 U5.49
SAUCE1: R37.2 U5.10
SAUCE2: R39.2 U5.11
SAUCE3: R45.2 U5.12
SAUCE4: R47.2 U5.25
SAUCE5: R53.2 U5.27
SAUCE6: R55.2 U5.29
SAUCE7: R57.2 U5.31
SAUCE8: R59.2 U5.33
SAUCE9: R65.2 U5.35
SAUCE10: R67.2 U5.37
SAUCE11: R73.2 U5.39
SAUCE12: R75.2 U5.41
SAUCE13: R61.2 U5.43
SAUCE14: R63.2 U5.45
SAUCE15: R69.2 U5.47
SCL: CN2.2 CN4.2 R12.2 U5.21(21(SCL))
SDA: CN2.3 CN4.3 R11.2 U5.20(20(SDA))
SPEED: R6.2 U5.23
$1N1435: D2.1(K) L1.1 U1.2(OUTPUT)
$1N1895: LED3.2(A) R8.2
$1N2489: R21.2 R22.2 U5.17(17(RX2)) U9.2(RE) U9.3(DE)
$1N2492: R19.2 U8.1 U9.6(A)
$1N2493: R17.2 U8.2 U9.7(B)
$1N2495: R20.2 U5.18(18(TX1)) U9.4(DI)
$1N2496: R23.2 U5.19(19(RX1)) U9.1(RO)
$1N27961: CN1.1 U2.7(OUT)
$1N27963: LED2.1(K) U2.3(FAULT#)
$1N27966: R2.2 R3.1 U2.1(IN) U2.2(DIAG_EN)
$1N27967: LED1.2(A) SW1.2
$1N27968: LED1.1(K) R2.1
$1N28864: R6.1 U4.1
$1N29013: Q1.1 U4.3
$1N29078: R4.1 U4.4
$1N30095: CN5.1 U7.7(OUT)
$1N30096: LED7.1(K) U7.3(FAULT#)
$1N30098: R15.2 R16.1 U7.1(IN) U7.2(DIAG_EN)
$1N30099: LED6.2(A) SW3.2
$1N30101: CN6.1 U10.7(OUT)
$1N30102: LED9.1(K) U10.3(FAULT#)
$1N30104: R24.2 R25.1 U10.1(IN) U10.2(DIAG_EN)
$1N30105: LED8.2(A) SW4.2
$1N30106: LED6.1(K) R15.1
$1N30107: LED8.1(K) R24.1
$1N30857: CN3.1 U6.7(OUT)
$1N30858: LED5.1(K) U6.3(FAULT#)
$1N30860: R10.2 R13.1 U6.1(IN) U6.2(DIAG_EN)
$1N30861: LED4.2(A) SW2.2
$1N30862: LED4.1(K) R10.1
$1N40166: D4.2(A) R78.1
$1N40255: D6.2(A) R80.1
$1N40272: CN8.2 D4.1(C) R36.1
$1N40502: C14.2 R36.2 U12.1(IN+)
$1N40648: C13.2 R30.1 R35.2 U12.3(IN-)
$1N41469: CN7.1 D5.1(C) R31.2
$1N41473: D3.2(A) R77.1
$1N41475: D5.2(A) R79.1
$1N41477: CN7.2 D3.1(C) R34.1
$1N41495: C12.2 R34.2 U11.1(IN+)
$1N41508: C11.2 R29.1 R33.2 U11.3(IN-)
$1N41577: CN8.1 D6.1(C) R32.2
$1N77477: C1.1 R5.1 R9.2 U1.4(FB)
$1N81553: D1.2(A) Q1.3 RLY1.1
$1N84548: R7.1 U2.4(CL)
$1N84632: C3.2 U2.5(DELAY)
$1N84711: R14.1 U6.4(CL)
$1N84726: C6.2 U6.5(DELAY)
$1N84812: C7.2 U7.5(DELAY)
$1N84816: R18.1 U7.4(CL)
$1N84902: C10.2 U10.5(DELAY)
$1N84906: R28.1 U10.4(CL)
$2N1526: CN11.1 U19.7(OUT)
$2N1528: LED23.1(K) U19.3(FAULT#)
$2N1542: R37.1 R38.2 U19.1(IN) U19.2(DIAG_EN)
$2N1548: LED25.2(A) SW7.2
$2N1552: CN12.1 U20.7(OUT)
$2N1554: LED24.1(K) U20.3(FAULT#)
$2N1568: R39.1 R40.2 U20.1(IN) U20.2(DIAG_EN)
$2N1574: LED26.2(A) SW8.2
$2N1576: LED25.1(K) R38.1
$2N1581: LED26.1(K) R40.1
$2N1610: CN13.1 U21.7(OUT)
$2N1612: LED27.1(K) U21.3(FAULT#)
$2N1626: R41.1 R42.2 U21.1(IN) U21.2(DIAG_EN)
$2N1632: LED29.2(A) SW9.2
$2N1636: CN14.1 U22.7(OUT)
$2N1638: LED28.1(K) U22.3(FAULT#)
$2N1652: R43.1 R44.2 U22.1(IN) U22.2(DIAG_EN)
$2N1658: LED30.2(A) SW10.2
$2N1660: LED29.1(K) R42.1
$2N1665: LED30.1(K) R44.1
$2N3164: CN15.1 U23.7(OUT)
$2N3166: LED31.1(K) U23.3(FAULT#)
$2N3180: R45.1 R46.2 U23.1(IN) U23.2(DIAG_EN)
$2N3186: LED33.2(A) SW11.2
$2N3190: CN16.1 U24.7(OUT)
$2N3192: LED32.1(K) U24.3(FAULT#)
$2N3206: R47.1 R48.2 U24.1(IN) U24.2(DIAG_EN)
$2N3212: LED34.2(A) SW12.2
$2N3214: LED33.1(K) R46.1
$2N3219: LED34.1(K) R48.1
$2N3248: CN17.1 U25.7(OUT)
$2N3250: LED35.1(K) U25.3(FAULT#)
$2N3264: R49.1 R50.2 U25.1(IN) U25.2(DIAG_EN)
$2N3270: LED37.2(A) SW13.2
$2N3274: CN18.1 U26.7(OUT)
$2N3276: LED36.1(K) U26.3(FAULT#)
$2N3290: R51.1 R52.2 U26.1(IN) U26.2(DIAG_EN)
$2N3296: LED38.2(A) SW14.2
$2N3298: LED37.1(K) R50.1
$2N3303: LED38.1(K) R52.1
$2N4802: CN19.1 U27.7(OUT)
$2N4804: LED39.1(K) U27.3(FAULT#)
$2N4818: R53.1 R54.2 U27.1(IN) U27.2(DIAG_EN)
$2N4824: LED41.2(A) SW15.2
$2N4828: CN20.1 U28.7(OUT)
$2N4830: LED40.1(K) U28.3(FAULT#)
$2N4844: R55.1 R56.2 U28.1(IN) U28.2(DIAG_EN)
$2N4850: LED42.2(A) SW16.2
$2N4852: LED41.1(K) R54.1
$2N4857: LED42.1(K) R56.1
$2N4886: CN21.1 U29.7(OUT)
$2N4888: LED43.1(K) U29.3(FAULT#)
$2N4902: R57.1 R58.2 U29.1(IN) U29.2(DIAG_EN)
$2N4908: LED45.2(A) SW17.2
$2N4912: CN22.1 U30.7(OUT)
$2N4914: LED44.1(K) U30.3(FAULT#)
$2N4928: R59.1 R60.2 U30.1(IN) U30.2(DIAG_EN)
$2N4934: LED46.2(A) SW18.2
$2N4936: LED45.1(K) R58.1
$2N4941: LED46.1(K) R60.1
$2N13352: C15.2 U21.5(DELAY)
$2N13356: R81.1 U21.4(CL)
$2N13442: C16.2 U22.5(DELAY)
$2N13446: R82.1 U22.4(CL)
$2N13626: R84.1 U26.4(CL)
$2N13642: C18.2 U26.5(DELAY)
$2N13716: C19.2 U25.5(DELAY)
$2N13720: R85.1 U25.4(CL)
$2N13806: C20.2 U19.5(DELAY)
$2N13810: R86.1 U19.4(CL)
$2N13896: C21.2 U20.5(DELAY)
$2N13900: R87.1 U20.4(CL)
$2N13986: C22.2 U23.5(DELAY)
$2N13990: R88.1 U23.4(CL)
$2N14076: C23.2 U24.5(DELAY)
$2N14080: R89.1 U24.4(CL)
$2N14166: C24.2 U27.5(DELAY)
$2N14170: R90.1 U27.4(CL)
$2N14256: C25.2 U28.5(DELAY)
$2N14260: R91.1 U28.4(CL)
$2N14346: C26.2 U29.5(DELAY)
$2N14350: R92.1 U29.4(CL)
$2N14436: C27.2 U30.5(DELAY)
$2N14440: R93.1 U30.4(CL)
$3N2975: CN23.1 U31.7(OUT)
$3N2976: LED47.1(K) U31.3(FAULT#)
$3N2978: R61.1 R62.2 U31.1(IN) U31.2(DIAG_EN)
$3N2979: LED49.2(A) SW19.2
$3N2981: CN24.1 U32.7(OUT)
$3N2982: LED48.1(K) U32.3(FAULT#)
$3N2984: R63.1 R64.2 U32.1(IN) U32.2(DIAG_EN)
$3N2985: LED50.2(A) SW20.2
$3N2986: LED49.1(K) R62.1
$3N2987: LED50.1(K) R64.1
$3N2992: CN25.1 U33.7(OUT)
$3N2993: LED51.1(K) U33.3(FAULT#)
$3N2995: R65.1 R66.2 U33.1(IN) U33.2(DIAG_EN)
$3N2996: LED53.2(A) SW21.2
$3N2998: CN26.1 U34.7(OUT)
$3N2999: LED52.1(K) U34.3(FAULT#)
$3N3001: R67.1 R68.2 U34.1(IN) U34.2(DIAG_EN)
$3N3002: LED54.2(A) SW22.2
$3N3003: LED53.1(K) R66.1
$3N3004: LED54.1(K) R68.1
$3N3009: CN27.1 U35.7(OUT)
$3N3010: LED55.1(K) U35.3(FAULT#)
$3N3012: R69.1 R70.2 U35.1(IN) U35.2(DIAG_EN)
$3N3013: LED57.2(A) SW23.2
$3N3015: CN28.1 U36.7(OUT)
$3N3016: LED56.1(K) U36.3(FAULT#)
$3N3018: R71.1 R72.2 U36.1(IN) U36.2(DIAG_EN)
$3N3019: LED58.2(A) SW24.2
$3N3020: LED57.1(K) R70.1
$3N3021: LED58.1(K) R72.1
$3N3026: CN29.1 U37.7(OUT)
$3N3027: LED59.1(K) U37.3(FAULT#)
$3N3029: R73.1 R74.2 U37.1(IN) U37.2(DIAG_EN)
$3N3030: LED61.2(A) SW25.2
$3N3032: CN30.1 U38.7(OUT)
$3N3033: LED60.1(K) U38.3(FAULT#)
$3N3035: R75.1 R76.2 U38.1(IN) U38.2(DIAG_EN)
$3N3036: LED62.2(A) SW26.2
$3N3037: LED61.1(K) R74.1
$3N3038: LED62.1(K) R76.1
$3N8700: C28.2 U33.5(DELAY)
$3N8704: R94.1 U33.4(CL)
$3N8790: C29.2 U34.5(DELAY)
$3N8794: R95.1 U34.4(CL)
$3N8880: C30.2 U37.5(DELAY)
$3N8884: R96.1 U37.4(CL)
$3N8970: C31.2 U38.5(DELAY)
$3N8974: R97.1 U38.4(CL)
$3N9060: C32.2 U31.5(DELAY)
$3N9064: R98.1 U31.4(CL)
$3N9150: C33.2 U32.5(DELAY)
$3N9154: R99.1 U32.4(CL)
$3N9240: C34.2 U35.5(DELAY)
$3N9244: R100.1 U35.4(CL)
$3N9330: C35.2 U36.5(DELAY)
$3N9334: R101.1 U36.4(CL)

Not connected (* = marked no-connect by the designer): U5 0(0(RX0)) 1(1(TX0)) 3.3V 13 14(14(TX3)) 15(15(RX3)) 16(16(TX2)) 22 24 26 28 30 32 34 36 38 40 42 44 46 48 50 52 53 A0(A0(RX0)) A1(A1(TX0)) A2 A3 A4 A7 A10 A11 A12 A13 A14 A15 AREF ISP1_1 ISP1_2 ISP1_3 ISP1_4 ISP1_5 ISP1_6 RESET
